# Altium schematic sheet 1_P1.schdoc
size 309 x 223 mm; Symbol: Sheet-Symbol_A4; Device: Sheet-Symbol_A4; @Page Name: P1; @Create Date: 2023-03-29; @Page Count: 1; @Page No: 1; @Project Name: NEW_clock; @Schematic Name: Schematic2; @Update Date: 2023-04-04; Company: 嘉立创EDA; Page Size: A4; Version: V1.0
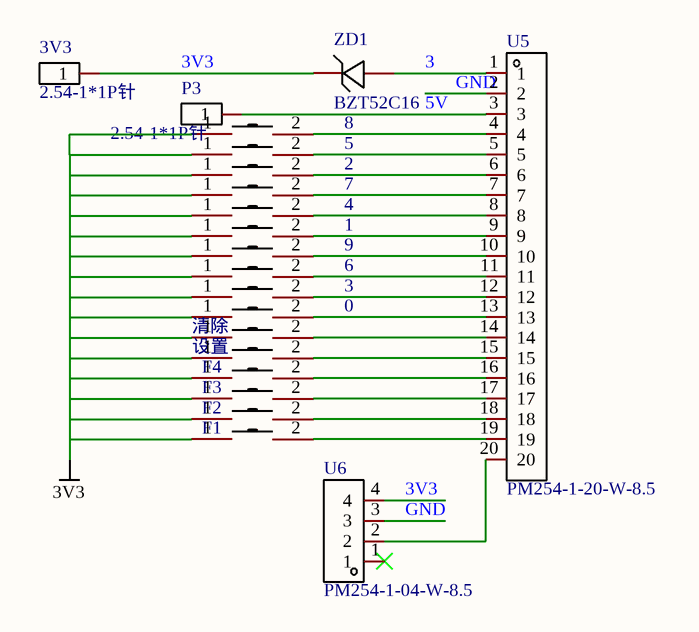
[diagram p0: 1_P1.schdoc]

## Parts
0  TS-1101-C-W  [SW-SMD_L6.0-W3.3-LS8.0]  (value not drawn)
1  TS-1101-C-W  [SW-SMD_L6.0-W3.3-LS8.0]  (value not drawn)
2  TS-1101-C-W  [SW-SMD_L6.0-W3.3-LS8.0]  (value not drawn)
3  TS-1101-C-W  [SW-SMD_L6.0-W3.3-LS8.0]  (value not drawn)
3V3  2.54-1*1P针  [HDR-TH_1P-P2.54-V-M]
4  TS-1101-C-W  [SW-SMD_L6.0-W3.3-LS8.0]  (value not drawn)
5  TS-1101-C-W  [SW-SMD_L6.0-W3.3-LS8.0]  (value not drawn)
6  TS-1101-C-W  [SW-SMD_L6.0-W3.3-LS8.0]  (value not drawn)
7  TS-1101-C-W  [SW-SMD_L6.0-W3.3-LS8.0]  (value not drawn)
8  TS-1101-C-W  [SW-SMD_L6.0-W3.3-LS8.0]  (value not drawn)
9  TS-1101-C-W  [SW-SMD_L6.0-W3.3-LS8.0]  (value not drawn)
F1  TS-1101-C-W  [SW-SMD_L6.0-W3.3-LS8.0]  (value not drawn)
F2  TS-1101-C-W  [SW-SMD_L6.0-W3.3-LS8.0]  (value not drawn)
F3  TS-1101-C-W  [SW-SMD_L6.0-W3.3-LS8.0]  (value not drawn)
F4  TS-1101-C-W  [SW-SMD_L6.0-W3.3-LS8.0]  (value not drawn)
P3  2.54-1*1P针  [HDR-TH_1P-P2.54-V-M]
U5  PM254-1-20-W-8.5  [HDR-TH_20P-P2.54-H-F-W10.0-N]
U6  PM254-1-04-W-8.5  [HDR-TH_4P-P2.54-H-F-W10.0-N]
ZD1  BZT52C16  [SOD-123_L2.8-W1.8-LS3.7-RD]
清除  TS-1101-C-W  [SW-SMD_L6.0-W3.3-LS8.0]  (value not drawn)
设置  TS-1101-C-W  [SW-SMD_L6.0-W3.3-LS8.0]  (value not drawn)

## Nets
3V3: 0.1 1.1 2.1 3.1 3V3.1 4.1 5.1 6.1 7.1 8.1 9.1 F1.1 F2.1 F3.1 F4.1 U6.4 ZD1.1(K) 清除.1 设置.1
3: U5.1 ZD1.2(A)
5V: P3.1 U5.3
GND: U5.2 U6.3
Net0_2: 0.2 U5.13
Net1_2: 1.2 U5.9
Net2_2: 2.2 U5.6
Net3_2: 3.2 U5.12
Net4_2: 4.2 U5.8
Net5_2: 5.2 U5.5
Net6_2: 6.2 U5.11
Net7_2: 7.2 U5.7
Net8_2: 8.2 U5.4
Net9_2: 9.2 U5.10
NetF1_2: F1.2 U5.19
NetF2_2: F2.2 U5.18
NetF3_2: F3.2 U5.17
NetF4_2: F4.2 U5.16
NetU5_14: U5.14 清除.2
NetU5_15: U5.15 设置.2
NetU5_20: U5.20 U6.2

Not connected (* = marked no-connect by the designer): U6 1*

## Notes on the sheet
- 1
- 2
- 3
- 4
- 5
- 6
- A
- B
- C
- Schematic
- Schematic2
- Create Date
- Update Date
- 2023-03-29
- 2023-04-04
- Reviewed
- Drawed
- Page
- P1
- Part Number
- NEW_clock
- D
- VER
- SIZE
- PAGE
- OF
- V1.0
- A4
- 嘉立创EDA

## Library data of the parts
0-9 F1-F4 清除 设置 = TS-1101-C-W: 触点电流:50mA;额定电压(DC):12V;绝缘电阻:-;电路结构:单刀单掷;安装方式:立贴;按钮形状:矩形按钮;按钮/盖帽颜色:白色;带灯:无;作用力:260gf;机械寿命:50000;工作温度:-30℃~+85℃;开关长度:6mm;开关宽度:3.6mm;开关高度:2.5mm;带支架:否;; Manufacturer: XKB Connectivity(中国星坤); Add into BOM: yes; Contact Current: 50mA; Voltage Rating (DC): 12V; Circuit: 单刀单掷; Actuator Style: 矩形按钮; Actuator/Cap Color: 白色; With Lamp: 无; Operating Force: 260gf; Mechanical Life: 50000; Switch Length: 6mm; Switch Width: 3.6mm; Switch Height: 2.5mm; Strike Gundam: 否; Name: TS-1101-C-W; Symbol: TS-1101-C-W; Device: TS-1101-C-W; LCSC Part Name: TS-1101-C-W 一型3*6*2.5有白ZD b拉伸白色按键 卷装; Supplier Part: C318938; Manufacturer Part: TS-1101-C-W; Supplier Footprint: SMD; JLCPCB Part Class: 扩展库; Datasheet: https://atta.szlcsc.com/upload/public/pdf/source/20200227/C318938_C2E53B1EEDE37D980A33616AC086DE53.pdf; Supplier: LCSC; Convert to PCB: yes; Insulation Resistance: -; Mounting Style: 立贴; Operating Temperature: -30℃~+85℃
3V3 P3 = 2.54-1*1P针: 排数:单排;总PIN位数:1;间距:-;插针结构:-;行距:-;安装类型:直插;圆针/方针:-;额定电流:-;额定电压:-;配合针长度:-;塑高:-;触头材质:-;触头镀层:-;颜色:黑色;; Manufacturer: BOOMELE(博穆精密); Symbol: Header-Male-2.54_1x1; Add into BOM: yes; Name: 2.54-1*1P针; Device: 2.54-1*1P针; LCSC Part Name: 直插; Supplier Part: C81276; Manufacturer Part: 2.54-1*1P针; Supplier Footprint: 插件,P=2.54mm; JLCPCB Part Class: Extended Part; Datasheet: https://atta.szlcsc.com/upload/public/pdf/source/20221018/3E9408392E35E6F57A28985E5F7BF5C9.pdf; Supplier: LCSC; Convert to PCB: yes; Number of Rows: 单排; Number of Pins: 1; Pitch: -; Pin Structure: -; Row Spacing: -; Mounting Type: 直插; Circluar Pins/Square Pins: -; Current Rating (Max): -; Voltage Rating (Max): -; Length of Mating Pin: -; Insulation Height: -; Contact Material: -; Contact Plating: -; Color: 黑色
U5 = PM254-1-20-W-8.5: 排数:单排;总孔位数:20;间距:2.54mm;插孔结构:1x20P;行距:-;安装类型:弯插;圆孔/方孔:方孔;额定电流:3A;额定电压:-;插孔方向:侧面;塑高:8.5mm;工作温度范围:-40℃~+105℃;; Manufacturer: HCTL(华灿天禄); Add into BOM: yes; Number of Holes: 20; Pitch: 2.54mm; Holes Structure: 1x20P; Circular Hole / Square Hole: 方孔; Current Rating (Max): 3A; Holes Direction: 侧面; Name: PM254-1-20-W-8.5; Symbol: PM254-1-20-W-8.5; Device: PM254-1-20-W-8.5; LCSC Part Name: 2.54mm 1x20P; Supplier Part: C2897402; Manufacturer Part: PM254-1-20-W-8.5; Supplier Footprint: 弯插,P=2.54mm; JLCPCB Part Class: 扩展库; Datasheet: https://atta.szlcsc.com/upload/public/pdf/source/20211019/10E5F374A8C70BEE256048F5DCDE14A3.pdf; Supplier: LCSC; Convert to PCB: yes; Number of Rows: 单排; Row Spacing: -; Mounting Type: 弯插; Voltage Rating (Max): -; Insulation Height: 8.5mm; Operating Temperature Range: -40℃~+105℃
U6 = PM254-1-04-W-8.5: 2.54MM单排排母塑高8.5 1*4 弯插; Manufacturer: HCTL(华灿天禄); Add into BOM: yes; Name: PM254-1-04-W-8.5; Symbol: PM254-1-04-W-8.5; Device: PM254-1-04-W-8.5; LCSC Part Name: 1x4P 2.54mm; Supplier Part: C2897386; Manufacturer Part: PM254-1-04-W-8.5; Supplier Footprint: 插件,P=2.54mm; JLCPCB Part Class: 扩展库; Datasheet: https://atta.szlcsc.com/upload/public/pdf/source/20211019/10E5F374A8C70BEE256048F5DCDE14A3.pdf; Supplier: LCSC; Convert to PCB: yes
ZD1 = BZT52C16_C2105: 二极管配置:独立式;稳压值(标称值):16V;稳压值(范围):15.3V~17.1V;精度:-;功率:350mW;反向电流(Ir):100nA@11.2V;阻抗(Zzt):40Ω;; Manufacturer: CJ（江苏长电/长晶）; Add into BOM: yes; Diode Configuration: 独立式; Zener Voltage (Nom): 16V; Power Dissipation: 350mW; Zener Impedance (Zzt): 40Ω; Name: BZT52C16; Symbol: BZT52C16_C2105; Device: BZT52C16_C2105; LCSC Part Name: 16V 350mW; Supplier Part: C2105; Manufacturer Part: BZT52C16; Supplier Footprint: SOD-123; JLCPCB Part Class: 扩展库; Datasheet: https://atta.szlcsc.com/upload/public/pdf/source/20140809/1457707207466.pdf; Supplier: LCSC; Convert to PCB: yes; Zener Voltage (Range): 15.3V~17.1V; Tolerance: -; Reverse Leakage Current (Ir): 100nA@11.2V